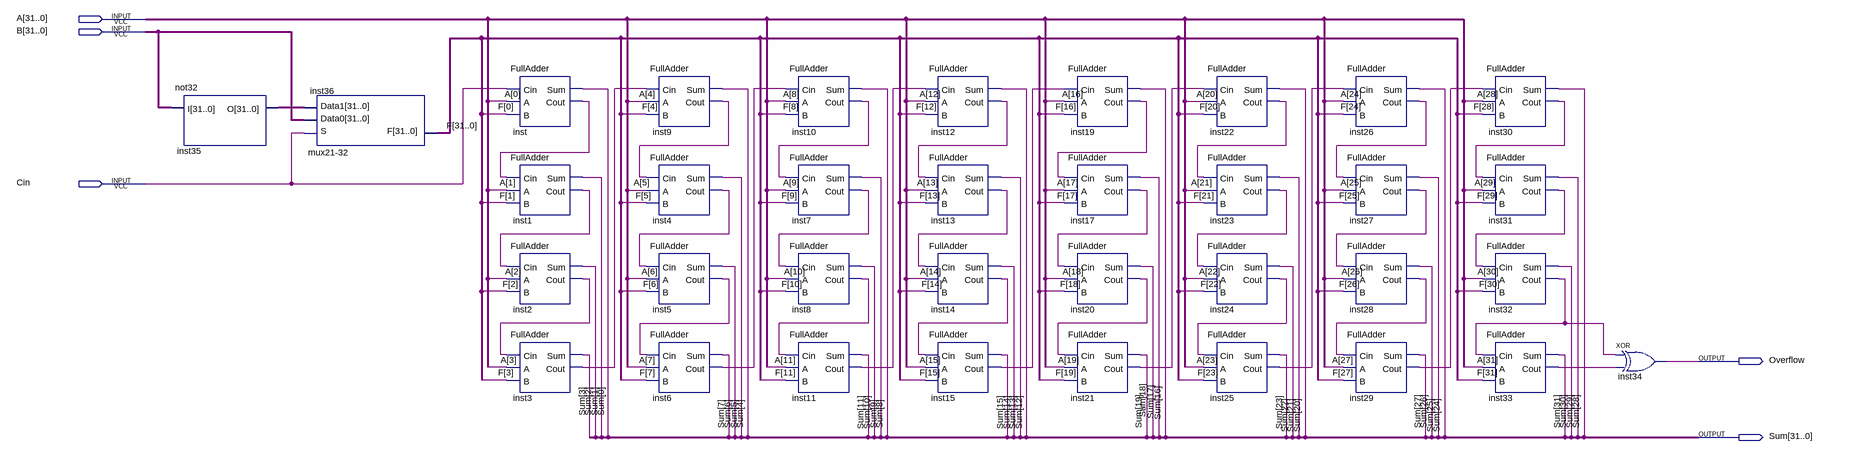
[diagram p0: schematic sheet]
// Quartus schematic Add.bdf as structural Verilog: 35 symbols, 5 pins
module Add (
  input  [31:0] A,
  input  [31:0] B,
  input  Cin,
  output Overflow,
  output [31:0] Sum
);

  wire inst1_cout, inst2_cout, inst3_cout, inst4_cout, inst5_cout, inst6_cout, inst7_cout, inst8_cout,
       inst9_cout, inst10_cout, inst11_cout, inst12_cout, inst13_cout, inst14_cout, inst15_cout, inst17_cout,
       inst19_cout, inst20_cout, inst21_cout, inst22_cout, inst23_cout, inst24_cout, inst25_cout,
       inst26_cout, inst27_cout, inst28_cout, inst29_cout, inst30_cout, inst31_cout, inst32_cout,
       inst33_cout, inst_cout;
  wire [31:0] F, inst35_o;

  not32 inst35 (.I(B), .O(inst35_o));
  \mux21-32  inst36 (.S(Cin), .Data0(B), .Data1(inst35_o), .F(F));
  FullAdder inst (.Cin(Cin), .A(A[0]), .B(F[0]), .Sum(Sum[0]), .Cout(inst_cout));
  FullAdder inst1 (.Cin(inst_cout), .A(A[1]), .B(F[1]), .Sum(Sum[1]), .Cout(inst1_cout));
  FullAdder inst2 (.Cin(inst1_cout), .A(A[2]), .B(F[2]), .Sum(Sum[2]), .Cout(inst2_cout));
  FullAdder inst3 (.Cin(inst2_cout), .A(A[3]), .B(F[3]), .Sum(Sum[3]), .Cout(inst3_cout));
  FullAdder inst9 (.Cin(inst3_cout), .A(A[4]), .B(F[4]), .Sum(Sum[4]), .Cout(inst9_cout));
  FullAdder inst4 (.Cin(inst9_cout), .A(A[5]), .B(F[5]), .Sum(Sum[5]), .Cout(inst4_cout));
  FullAdder inst5 (.Cin(inst4_cout), .A(A[6]), .B(F[6]), .Sum(Sum[6]), .Cout(inst5_cout));
  FullAdder inst6 (.Cin(inst5_cout), .A(A[7]), .B(F[7]), .Sum(Sum[7]), .Cout(inst6_cout));
  FullAdder inst10 (.Cin(inst6_cout), .A(A[8]), .B(F[8]), .Sum(Sum[8]), .Cout(inst10_cout));
  FullAdder inst7 (.Cin(inst10_cout), .A(A[9]), .B(F[9]), .Sum(Sum[9]), .Cout(inst7_cout));
  FullAdder inst8 (.Cin(inst7_cout), .A(A[10]), .B(F[10]), .Sum(Sum[10]), .Cout(inst8_cout));
  FullAdder inst11 (.Cin(inst8_cout), .A(A[11]), .B(F[11]), .Sum(Sum[11]), .Cout(inst11_cout));
  FullAdder inst12 (.Cin(inst11_cout), .A(A[12]), .B(F[12]), .Sum(Sum[12]), .Cout(inst12_cout));
  FullAdder inst13 (.Cin(inst12_cout), .A(A[13]), .B(F[13]), .Sum(Sum[13]), .Cout(inst13_cout));
  FullAdder inst14 (.Cin(inst13_cout), .A(A[14]), .B(F[14]), .Sum(Sum[14]), .Cout(inst14_cout));
  FullAdder inst15 (.Cin(inst14_cout), .A(A[15]), .B(F[15]), .Sum(Sum[15]), .Cout(inst15_cout));
  FullAdder inst19 (.Cin(inst15_cout), .A(A[16]), .B(F[16]), .Sum(Sum[16]), .Cout(inst19_cout));
  FullAdder inst17 (.Cin(inst19_cout), .A(A[17]), .B(F[17]), .Sum(Sum[17]), .Cout(inst17_cout));
  FullAdder inst20 (.Cin(inst17_cout), .A(A[18]), .B(F[18]), .Sum(Sum[18]), .Cout(inst20_cout));
  FullAdder inst21 (.Cin(inst20_cout), .A(A[19]), .B(F[19]), .Sum(Sum[19]), .Cout(inst21_cout));
  FullAdder inst22 (.Cin(inst21_cout), .A(A[20]), .B(F[20]), .Sum(Sum[20]), .Cout(inst22_cout));
  FullAdder inst23 (.Cin(inst22_cout), .A(A[21]), .B(F[21]), .Sum(Sum[21]), .Cout(inst23_cout));
  FullAdder inst24 (.Cin(inst23_cout), .A(A[22]), .B(F[22]), .Sum(Sum[22]), .Cout(inst24_cout));
  FullAdder inst25 (.Cin(inst24_cout), .A(A[23]), .B(F[23]), .Sum(Sum[23]), .Cout(inst25_cout));
  FullAdder inst26 (.Cin(inst25_cout), .A(A[24]), .B(F[24]), .Sum(Sum[24]), .Cout(inst26_cout));
  FullAdder inst27 (.Cin(inst26_cout), .A(A[25]), .B(F[25]), .Sum(Sum[25]), .Cout(inst27_cout));
  FullAdder inst28 (.Cin(inst27_cout), .A(A[26]), .B(F[26]), .Sum(Sum[26]), .Cout(inst28_cout));
  FullAdder inst29 (.Cin(inst28_cout), .A(A[27]), .B(F[27]), .Sum(Sum[27]), .Cout(inst29_cout));
  FullAdder inst30 (.Cin(inst29_cout), .A(A[28]), .B(F[28]), .Sum(Sum[28]), .Cout(inst30_cout));
  FullAdder inst31 (.Cin(inst30_cout), .A(A[29]), .B(F[29]), .Sum(Sum[29]), .Cout(inst31_cout));
  FullAdder inst32 (.Cin(inst31_cout), .A(A[30]), .B(F[30]), .Sum(Sum[30]), .Cout(inst32_cout));
  FullAdder inst33 (.Cin(inst32_cout), .A(A[31]), .B(F[31]), .Sum(Sum[31]), .Cout(inst33_cout));
  xor inst34 (Overflow, inst32_cout, inst33_cout);
endmodule
